# Altium schematic sheet power.SchDoc: Opo4
size Letter; Author: William W. Huang; Organization: Altium Limited; Address1: L3, 12a Rodborough Rd; Address2: Frenchs Forest; Address3: NSW; Address4: Australia 2086; Revision: 1
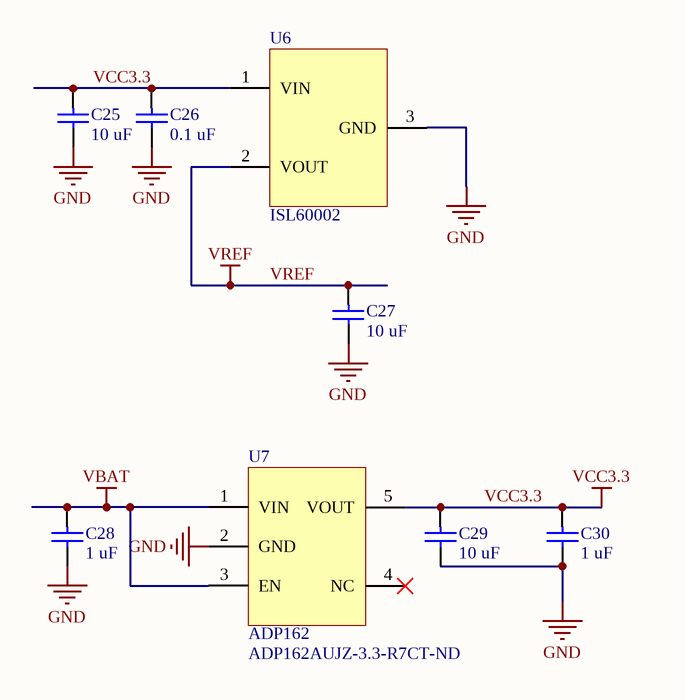
[diagram p0: power.SchDoc]

## Parts
C25  value 10 uF  [0603]  (hidden comment: Ceramic capacitor)
C26  value 0.1 uF  [0402]  (hidden comment: Ceramic capacitor)
C27  value 10 uF  [0603]  (hidden comment: Ceramic capacitor)
C28  value 1 uF  [0402]  (hidden comment: Ceramic capacitor)
C29  value 10 uF  [0603]  (hidden comment: Ceramic capacitor)
C30  value 1 uF  [0402]  (hidden comment: Ceramic capacitor)
U6  ISL60002  [SOT23-3N]
U7  ADP162  Supplier Part Number 1: ADP162AUJZ-3.3-R7CT-ND  [TSOT23-5]

## Nets
GND: C25.2 C26.2 C27.2 C28.2 C29.2 C30.2 U6.3(GND) U7.2(GND)
VBAT: C28.1 U7.1(VIN) U7.3(EN)
VCC3.3: C25.1 C26.1 C29.1 C30.1 U6.1(VIN) U7.5(VOUT)
VREF: C27.1 U6.2(VOUT)

Not connected (* = marked no-connect by the designer): U7 4(NC)*

## Notes on the sheet
- Title
- Date:
- Author:
- Revision:
- Sheet
- of
- University of Michigan
- File:

## Library data of the parts
C25 C27 C29 = C_10u_0603_ceramic: Ceramic capacitor, 10 uF, 0603 package; Manufacture: TDK; voltage rated: 6.3V; tolerance: 20%; package: 0603; Supplier 1: Digi-Key; Supplier Part Number 1: 445-4112-1-ND
C26 = C_0.1u_0402_ceramic: Ceramic capacitor, 0.1u, 0402 package; Manufacture: TDK; voltage rated: 10 V; tolerance: 10%; Supplier 1: Digi-Key; Supplier Part Number 1: 445-1265-1-ND; package: 0402
C28 C30 = C_1u_0402_ceramic: Ceramic capacitor, 1 uF, 0402 package; Manufacture: TDK; voltage rated: 6.3 V; tolerance: 10%; package: 0402; Supplier 1: Digi-Key; Supplier Part Number 1: 445-5000-1-ND
U6 = ISL60002: IC VREF SERIES PREC SOT-23-3; Supplier 1: Digi-Key; Supplier Part Number 1: ISL60002DIH310Z-TKCT-ND
U7 = ADP162: Ultralow Quiescent Current,  150 mA, CMOS Linear Regulators; Supplier 1: Digi-Key